# EAGLE design ADSR (EAGLE 9.5.2)
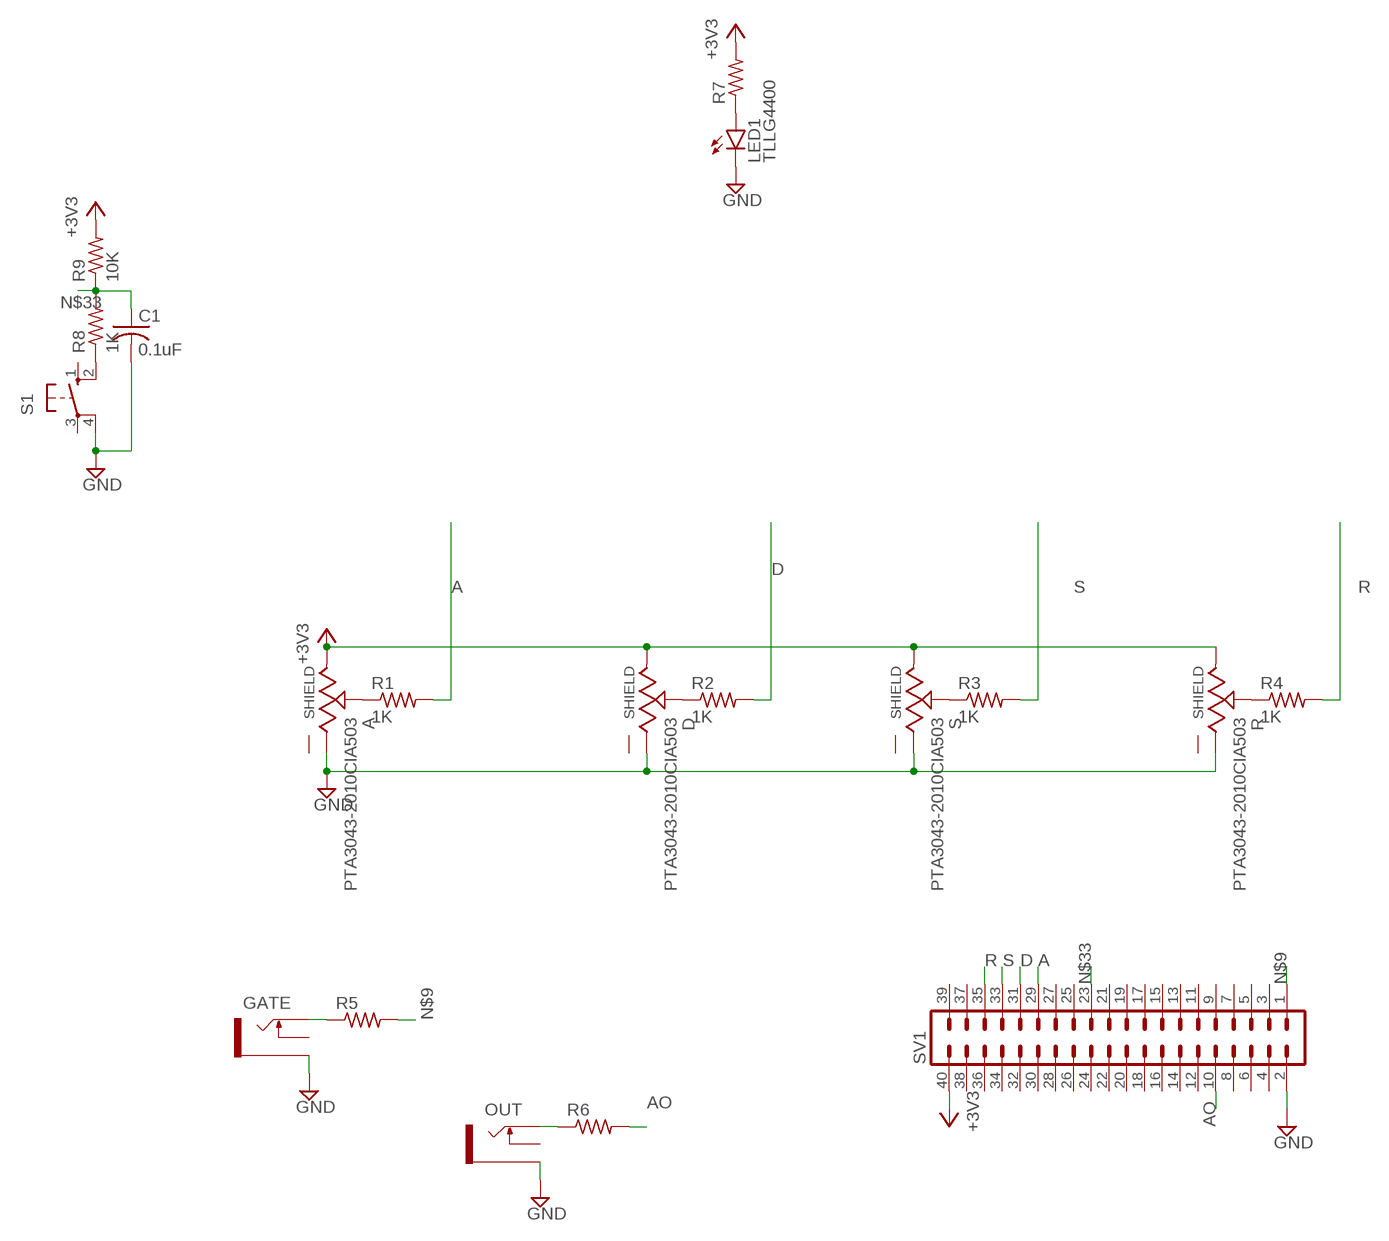
[diagram p0: schematic, sheet 1]

## Parts
A  PTA3043-2010CIA503  [TRIM_PTA3043-2010CIA503]
C1  0.1uF  C-US025-024X044  [C025-024X044]
D  PTA3043-2010CIA503  [TRIM_PTA3043-2010CIA503]
GATE  THONKICONNNEW  [WQP-PJ301M-12_JACK]
LED1  TLLG4400  [LED3MM]
OUT  THONKICONNNEW  [WQP-PJ301M-12_JACK]
R  PTA3043-2010CIA503  [TRIM_PTA3043-2010CIA503]
R1  1K  R-US_0207/10  [0207/10]
R2  1K  R-US_0207/10  [0207/10]
R3  1K  R-US_0207/10  [0207/10]
R4  1K  R-US_0207/10  [0207/10]
R5  R-US_0207/10  [0207/10]
R6  R-US_0207/10  [0207/10]
R7  R-US_0207/10  [0207/10]
R8  1K  R-US_0207/10  [0207/10]
R9  10K  R-US_0207/10  [0207/10]
S  PTA3043-2010CIA503  [TRIM_PTA3043-2010CIA503]
S1  10-XX  [B3F-10XX]
SV1  MA20-2  [MA20-2]

## Nets
+3V3: A.1 D.1 R7.2 R9.2 R.1 S.1 SV1.40
A: R1.2 SV1.29
AO: R6.2 SV1.10
D: R2.2 SV1.31
GND: A.3 C1.2 D.3 GATE.P$3_SLEEVE(SLEEVE) LED1.K(C) OUT.P$3_SLEEVE(SLEEVE) R.3 S1.4(P1) S.3 SV1.2
N$1: A.2 R1.1
N$2: D.2 R2.1
N$3: R3.1 S.2
N$4: R4.1 R.2
N$5: OUT.P$1_TIP(TIP) R6.1
N$6: LED1.A R7.1
N$7: R8.1 S1.2(S1)
N$9: R5.2 SV1.1
N$11: GATE.P$1_TIP(TIP) R5.1
N$33: C1.1 R8.2 R9.1 SV1.23
R: R4.2 SV1.35
S: R3.2 SV1.33
Unconnected: A.P1(SHIELD) A.P2(SHIELD) A.P3(SHIELD) A.P4(SHIELD) D.P1(SHIELD) D.P2(SHIELD) D.P3(SHIELD) D.P4(SHIELD) GATE.P$2_SWITCH(SWITCH) OUT.P$2_SWITCH(SWITCH) R.P1(SHIELD) R.P2(SHIELD) R.P3(SHIELD) R.P4(SHIELD) S1.1(S) S1.3(P) S.P1(SHIELD) S.P2(SHIELD) S.P3(SHIELD) S.P4(SHIELD) SV1.3 SV1.4 SV1.5 SV1.6 SV1.7 SV1.8 SV1.9 SV1.11 SV1.12 SV1.13 SV1.14 SV1.15 SV1.16 SV1.17 SV1.18 SV1.19 SV1.20 SV1.21 SV1.22 SV1.24 SV1.25 SV1.26 SV1.27 SV1.28 SV1.30 SV1.32 SV1.34 SV1.36 SV1.37 SV1.38 SV1.39

## Library data of the parts
A D R S = PTA3043-2010CIA503:PTA3043-2010CIA503: Res Carbon Film POT 50K Ohm 20% 0.1W(1/10W) (45 X 9 X 19.5mm) Pin Thru-Hole Automotive; AVAILABILITY: Unavailable; DESCRIPTION: Res Carbon Film POT 50K Ohm 20% 0.1W_1/10W_ _45 X 9 X 19.5mm_ Pin Thru-Hole Automotive; MF: Bourns; MP: PTA3043-2010CIA503; PACKAGE: DIP-6 Bourns; PRICE: None
C1 = rcl:C-US: CAPACITOR, American symbol; SPICEPREFIX: C
GATE OUT = MusicThingModular:THONKICONN: 3.5mm socket for Eurorack modular synths
LED1 = led:TLLG4400: Low Current (2mA) LED 3 mm Tinted Diffused Package color GREEN Source: Data sheet <http://www.farnell.com/datasheets/391098.pdf>; MF: VISHAY SEMICONDUCTOR; OC_FARNELL: 1612435
R1-R9 = rcl:R-US_: RESISTOR, American symbol; SPICEPREFIX: R
S1 = switch-omron:10-XX: OMRON SWITCH; MPN: B3F-1000; OC_FARNELL: 176432; OC_NEWARK: 36M3542
SV1 = con-lstb:MA20-2: PIN HEADER; OC_FARNELL: unknown; OC_NEWARK: unknown

## Board
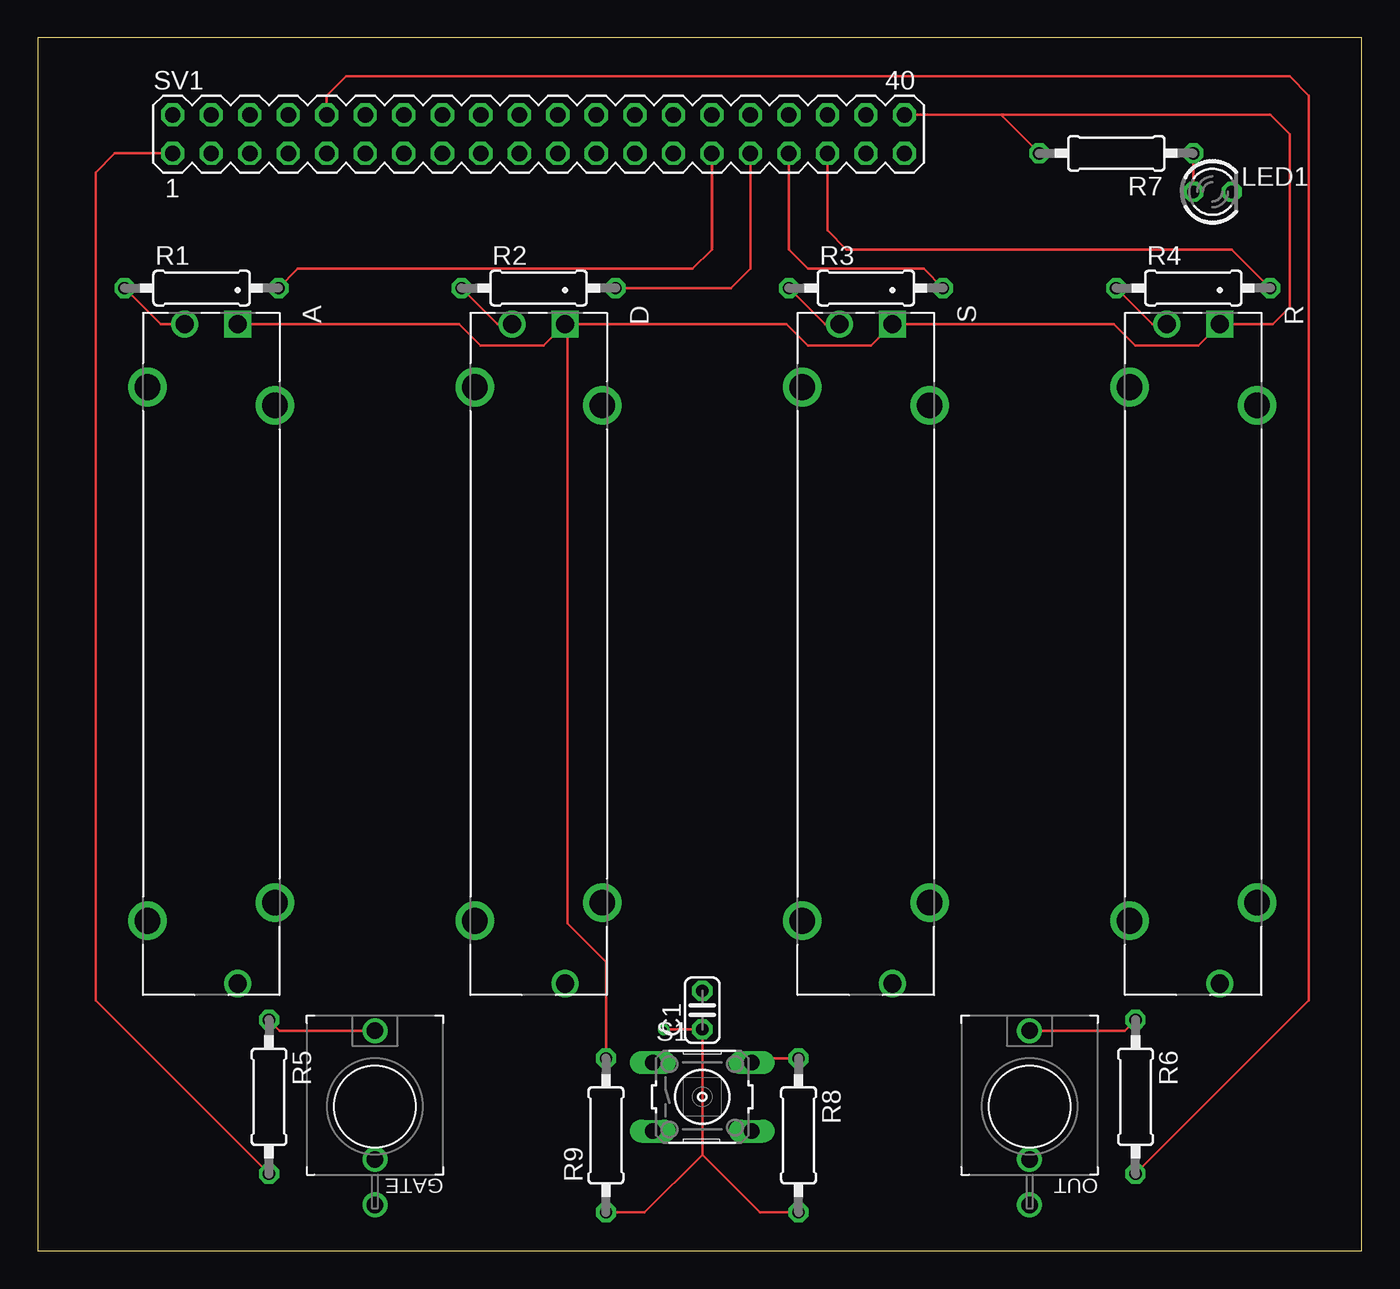
[diagram p1: board, top side]
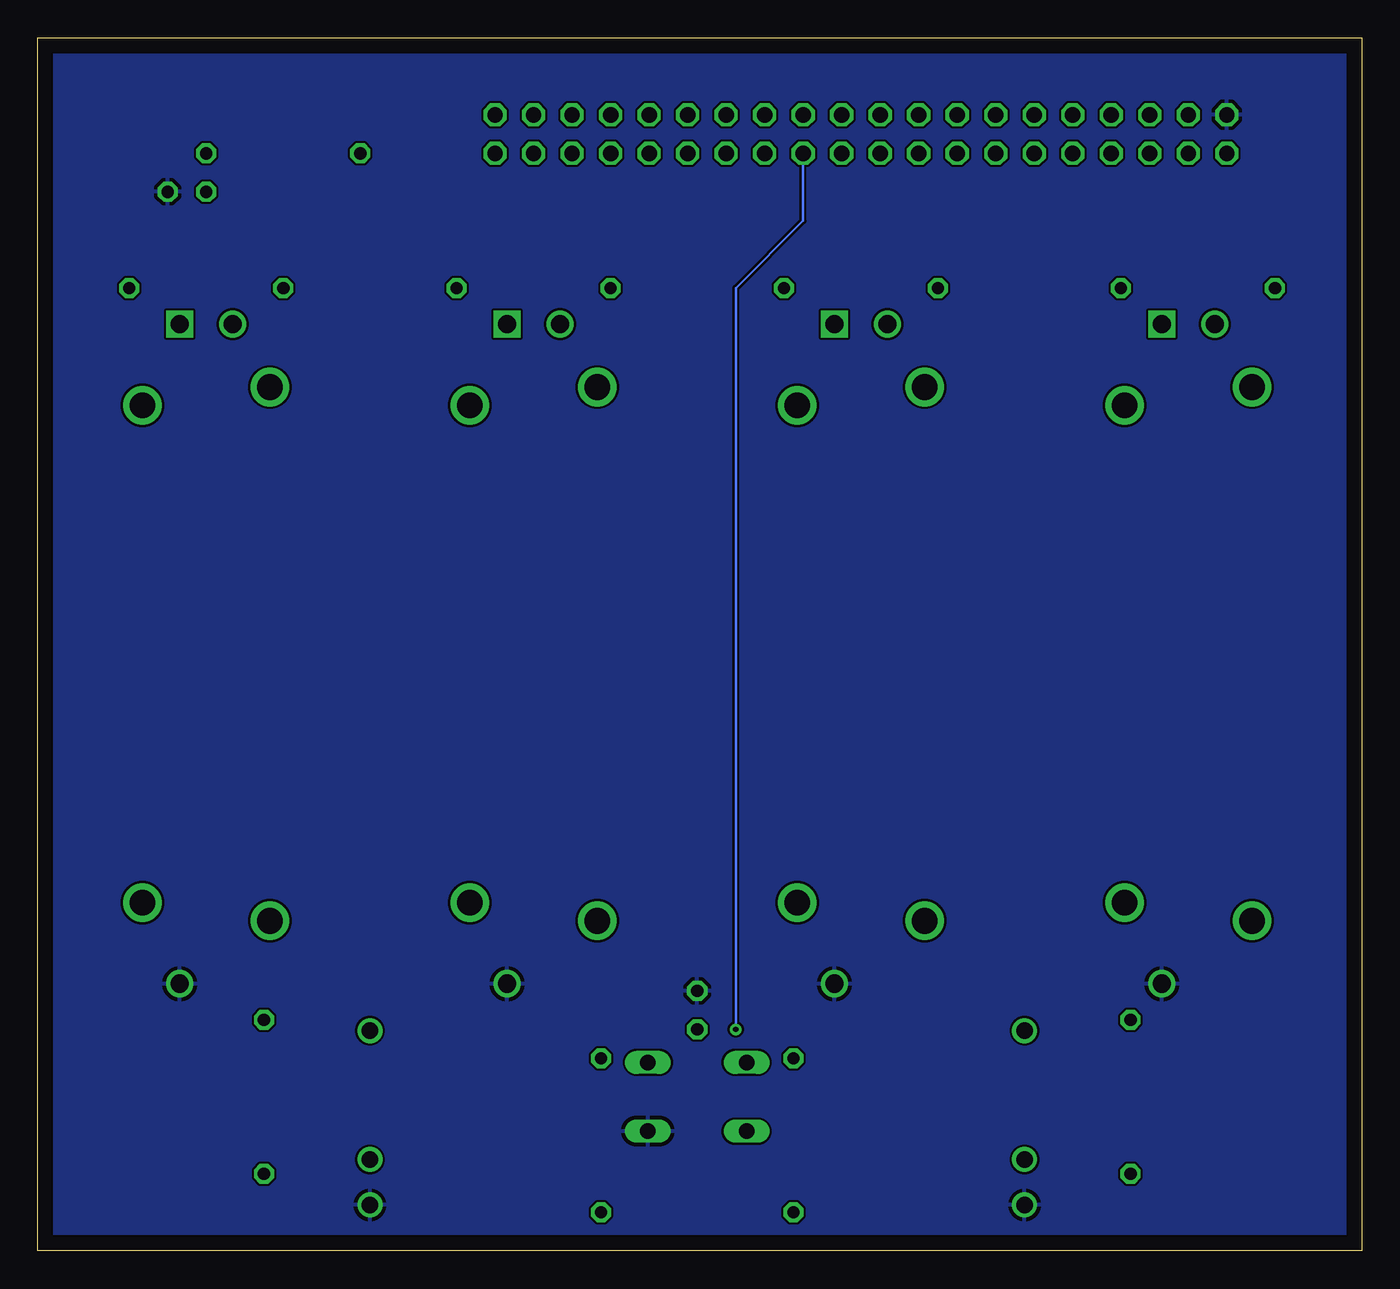
[diagram p2: board, bottom side, seen from below]

Size 87.3 x 80 mm. Coordinates in mm from the lower left corner, seen from the top.
Outline: 0,0 87.3,0 87.3,80 0,80 0,0
Copper layers (1*16): Top 0.035mm / dielectric 1.5mm / Bottom 0.035mm
Design rules "default": minimum track width 6mil, minimum drill 0.35mm, track to track 6mil, track to pad 6mil, pad to pad 6mil, via to via 6mil, smd to smd 6mil, copper to edge 40mil, drill to drill 6mil, minimum pad ring 10mil, minimum via ring 8mil, stop-mask expansion 4mil, vias tented up to drill 0mil, thermal gap 10mil

### Footprints (pad centres in the part's own frame; a part is rotated, then mirrored left to right if it is on the bottom)
TRIM_PTA3043-2010CIA503 = drill 1.2 square: 1 -21.75,1.75 | drill 1.2: 2 -21.75,-1.75; 3 21.75,1.75 | drill 1.7: P1 -16.4,4.2; P2 16.4,4.2; P3 -17.6,-4.2; P4 17.6,-4.2
C025-024X044 = drill 0.813 octagon: 1 -1.27,0; 2 1.27,0
WQP-PJ301M-12_JACK = drill 1.1: P$1_TIP 0,5; P$2_SWITCH 0,-3.5; P$3_SLEEVE 0,-6.5
LED3MM = drill 0.813 octagon: A -1.27,0; K 1.27,0
0207/10 = drill 0.813 octagon: 1 -5.08,0; 2 5.08,0
B3F-10XX = drill 1.016 long: 1 -3.251,2.261; 2 3.251,2.261; 3 -3.251,-2.261; 4 3.251,-2.261
MA20-2 = drill 1.016 octagon: 1 -24.13,-1.27; 2 -24.13,1.27; 3 -21.59,-1.27; 4 -21.59,1.27; 5 -19.05,-1.27; 6 -19.05,1.27; 7 -16.51,-1.27; 8 -16.51,1.27; 9 -13.97,-1.27; 10 -13.97,1.27; 11 -11.43,-1.27; 12 -11.43,1.27; 13 -8.89,-1.27; 14 -8.89,1.27; 15 -6.35,-1.27; 16 -6.35,1.27; 17 -3.81,-1.27; 18 -3.81,1.27; 19 -1.27,-1.27; 20 -1.27,1.27; 21 1.27,-1.27; 22 1.27,1.27; 23 3.81,-1.27; 24 3.81,1.27; 25 6.35,-1.27; 26 6.35,1.27; 27 8.89,-1.27; 28 8.89,1.27; 29 11.43,-1.27; 30 11.43,1.27; 31 13.97,-1.27; 32 13.97,1.27; 33 16.51,-1.27; 34 16.51,1.27; 35 19.05,-1.27; 36 19.05,1.27; 37 21.59,-1.27; 38 21.59,1.27; 39 24.13,-1.27; 40 24.13,1.27

### Placement (x,y rotation side)
A  11.43,39.37 270 top
C1  43.81,15.88 90 top
D  33.02,39.37 270 top
GATE  22.23,9.53 0 top
LED1  77.47,69.85 0 top
OUT  65.41,9.53 0 top
R  76.2,39.37 270 top
R1  10.79,63.5 0 top
R2  33.02,63.5 0 top
R3  54.61,63.5 0 top
R4  76.2,63.5 0 top
R5  15.24,10.16 270 top
R6  72.39,10.16 270 top
R7  71.12,72.39 180 top
R8  50.16,7.62 270 top
R9  37.47,7.62 90 top
S  54.61,39.37 270 top
S1  43.81,10.16 0 top
SV1  33.02,73.66 0 top

### Tracks (layer width: path | path; a pad name or v marks a point on that pad's centre or on a via)
+3V3
  Top 0.152: 34.92,61.12 49.37,61.12 50.8,59.69 54.93,59.69 S.1 70.96,61.12 72.39,59.69 76.52,59.69 R.1 81.44,61.12 82.55,62.23 82.55,73.66 81.28,74.93 63.5,74.93 | 34.92,61.12 D.1 33.34,59.69 29.21,59.69 27.78,61.12 A.1 | 63.5,74.93 SV1.40 | 63.5,74.93 R7.2 | R9.2 37.47,19.05 34.92,21.59 34.92,61.12
A
  Top 0.152: R1.2 17.14,64.77 43.18,64.77 44.45,66.04 SV1.29
AO
  Top 0.152: R6.2 83.82,16.51 83.82,76.2 82.55,77.47 20.32,77.47 19.05,76.2 SV1.10
D
  Top 0.152: R2.2 45.72,63.5 46.99,64.77 SV1.31
GND
  pour Bottom: 0,0 0,80.01 87.63,80.01 87.63,0
N$1
  Top 0.152: R1.1 8.1,61.12 A.2
N$2
  Top 0.152: R2.1 30.32,61.12 D.2
N$3
  Top 0.152: R3.1 51.91,61.12 S.2
N$4
  Top 0.152: R4.1 73.5,61.12 R.2
N$5
  Top 0.152: OUT.P$1_TIP 71.67,14.53 R6.1
N$6
  Top 0.152: R7.1 LED1.A
N$7
  Top 0.152: S1.2 47.35,12.7 R8.1
N$9
  Top 0.152: R5.2 3.81,16.51 3.81,71.12 5.08,72.39 SV1.1
N$11
  Top 0.152: GATE.P$1_TIP 15.96,14.53 R5.1
N$33  (via drill 0.35)
  Top 0.152: 43.81,6.35 C1.1 v41.27,14.61 | 43.81,6.35 47.62,2.54 R8.2 | R9.1 40.01,2.54 43.81,6.35
  Bottom 0.152: v41.27,14.61 41.27,63.5 36.83,67.94 SV1.23
R
  Top 0.152: SV1.35 52.07,67.31 53.34,66.04 78.74,66.04 R4.2
S
  Top 0.152: SV1.33 49.53,66.04 50.8,64.77 58.42,64.77 R3.2